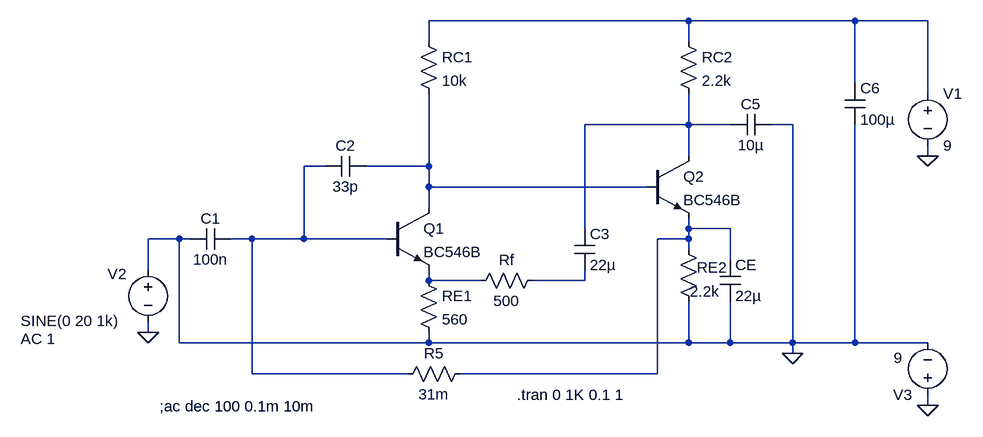
[diagram p0: schematic Project_Preamplifier.asc]
Project_Preamplifier.asc, the LTspice schematic file:
Version 4
SHEET 1 1180 680
WIRE 752 -240 352 -240
WIRE 1008 -240 752 -240
WIRE 1120 -240 1008 -240
WIRE 352 -208 352 -240
WIRE 752 -208 752 -240
WIRE 1008 -144 1008 -240
WIRE 1120 -128 1120 -240
WIRE 752 -80 752 -128
WIRE 752 -80 592 -80
WIRE 816 -80 752 -80
WIRE 912 -80 880 -80
WIRE 752 -32 752 -80
WIRE 1120 -32 1120 -48
WIRE 192 -16 160 -16
WIRE 352 -16 352 -128
WIRE 352 -16 256 -16
WIRE 352 16 352 -16
WIRE 688 16 352 16
WIRE 352 48 352 16
WIRE 592 80 592 -80
WIRE 752 80 752 64
WIRE 816 80 752 80
WIRE -32 96 -80 96
WIRE -16 96 -32 96
WIRE 80 96 48 96
WIRE 160 96 160 -16
WIRE 160 96 80 96
WIRE 288 96 160 96
WIRE 752 96 752 80
WIRE 752 96 704 96
WIRE 752 112 752 96
WIRE 816 128 816 80
WIRE -80 144 -80 96
WIRE 352 160 352 144
WIRE 432 160 352 160
WIRE 592 160 592 144
WIRE 592 160 512 160
WIRE -80 240 -80 224
WIRE -32 256 -32 96
WIRE 352 256 352 240
WIRE 352 256 -32 256
WIRE 752 256 752 192
WIRE 752 256 352 256
WIRE 816 256 816 192
WIRE 816 256 752 256
WIRE 912 256 912 -80
WIRE 912 256 816 256
WIRE 1008 256 1008 -80
WIRE 1008 256 912 256
WIRE 1120 256 1008 256
WIRE 912 272 912 256
WIRE 80 304 80 96
WIRE 320 304 80 304
WIRE 704 304 704 96
WIRE 704 304 400 304
WIRE 1120 352 1120 336
FLAG -80 240 0
FLAG 1120 -32 0
FLAG 1120 352 0
FLAG 912 272 0
SYMBOL cap 48 80 R90
WINDOW 0 0 32 VBottom 2
WINDOW 3 32 32 VTop 2
SYMATTR InstName C1
SYMATTR Value 100n
SYMBOL cap 256 -32 R90
WINDOW 0 0 32 VBottom 2
WINDOW 3 32 32 VTop 2
SYMATTR InstName C2
SYMATTR Value 33p
SYMBOL res 336 -224 R0
SYMATTR InstName RC1
SYMATTR Value 10k
SYMBOL npn 288 48 R0
SYMATTR InstName Q1
SYMATTR Value BC546B
SYMBOL res 528 144 R90
WINDOW 0 0 56 VBottom 2
WINDOW 3 32 56 VTop 2
SYMATTR InstName Rf
SYMATTR Value 500
SYMBOL res 336 144 R0
SYMATTR InstName RE1
SYMATTR Value 560
SYMBOL res 416 288 R90
WINDOW 0 0 56 VBottom 2
WINDOW 3 32 56 VTop 2
SYMATTR InstName R5
SYMATTR Value 31m
SYMBOL cap 576 80 R0
SYMATTR InstName C3
SYMATTR Value 22µ
SYMBOL res 736 -224 R0
SYMATTR InstName RC2
SYMATTR Value 2.2k
SYMBOL cap 880 -96 R90
WINDOW 0 0 32 VBottom 2
WINDOW 3 32 32 VTop 2
SYMATTR InstName C5
SYMATTR Value 10µ
SYMBOL npn 688 -32 R0
SYMATTR InstName Q2
SYMATTR Value BC546B
SYMBOL cap 800 128 R0
SYMATTR InstName CE
SYMATTR Value 22µ
SYMBOL res 736 96 R0
WINDOW 0 29 44 Left 2
WINDOW 3 18 81 Left 2
SYMATTR InstName RE2
SYMATTR Value 2.2k
SYMBOL cap 992 -144 R0
SYMATTR InstName C6
SYMATTR Value 100µ
SYMBOL voltage 1120 -144 R0
WINDOW 123 0 0 Left 0
WINDOW 39 0 0 Left 0
SYMATTR InstName V1
SYMATTR Value 9
SYMBOL voltage -80 128 R0
WINDOW 0 -62 22 Left 2
WINDOW 3 -196 94 Left 2
WINDOW 123 -196 122 Left 2
WINDOW 39 0 0 Left 0
SYMATTR InstName V2
SYMATTR Value SINE(0 20 1k)
SYMATTR Value2 AC 1
SYMBOL voltage 1120 352 R180
WINDOW 3 39 73 Left 2
WINDOW 123 0 0 Left 0
WINDOW 39 0 0 Left 0
SYMATTR InstName V3
SYMATTR Value 9
TEXT -62 354 Left 2 !;ac dec 100 0.1m 10m
TEXT 488 336 Left 2 !.tran 0 1K 0.1 1

The netlist it stands for:
* Project_Preamplifier.asc
C1 N003 0 100n
C2 N004 N003 33p
RC1 N001 N004 10k
Q1 N004 N003 N006 0 BC546B
Rf N007 N006 500
RE1 N006 0 560
R5 N005 N003 31m
C3 N002 N007 22µ
RC2 N001 N002 2.2k
C5 0 N002 10µ
Q2 N002 N004 N005 0 BC546B
CE N005 0 22µ
RE2 N005 0 2.2k
C6 N001 0 100µ
V1 N001 0 9
V2 0 0 SINE(0 20 1k) AC 1
V3 0 0 9
.model NPN NPN
.model PNP PNP
.lib standard.bjt
;ac dec 100 0.1m 10m
.tran 0 1K 0.1 1
.backanno
.end